# Altium schematic sheet Temctrl_I.SchDoc
size A4
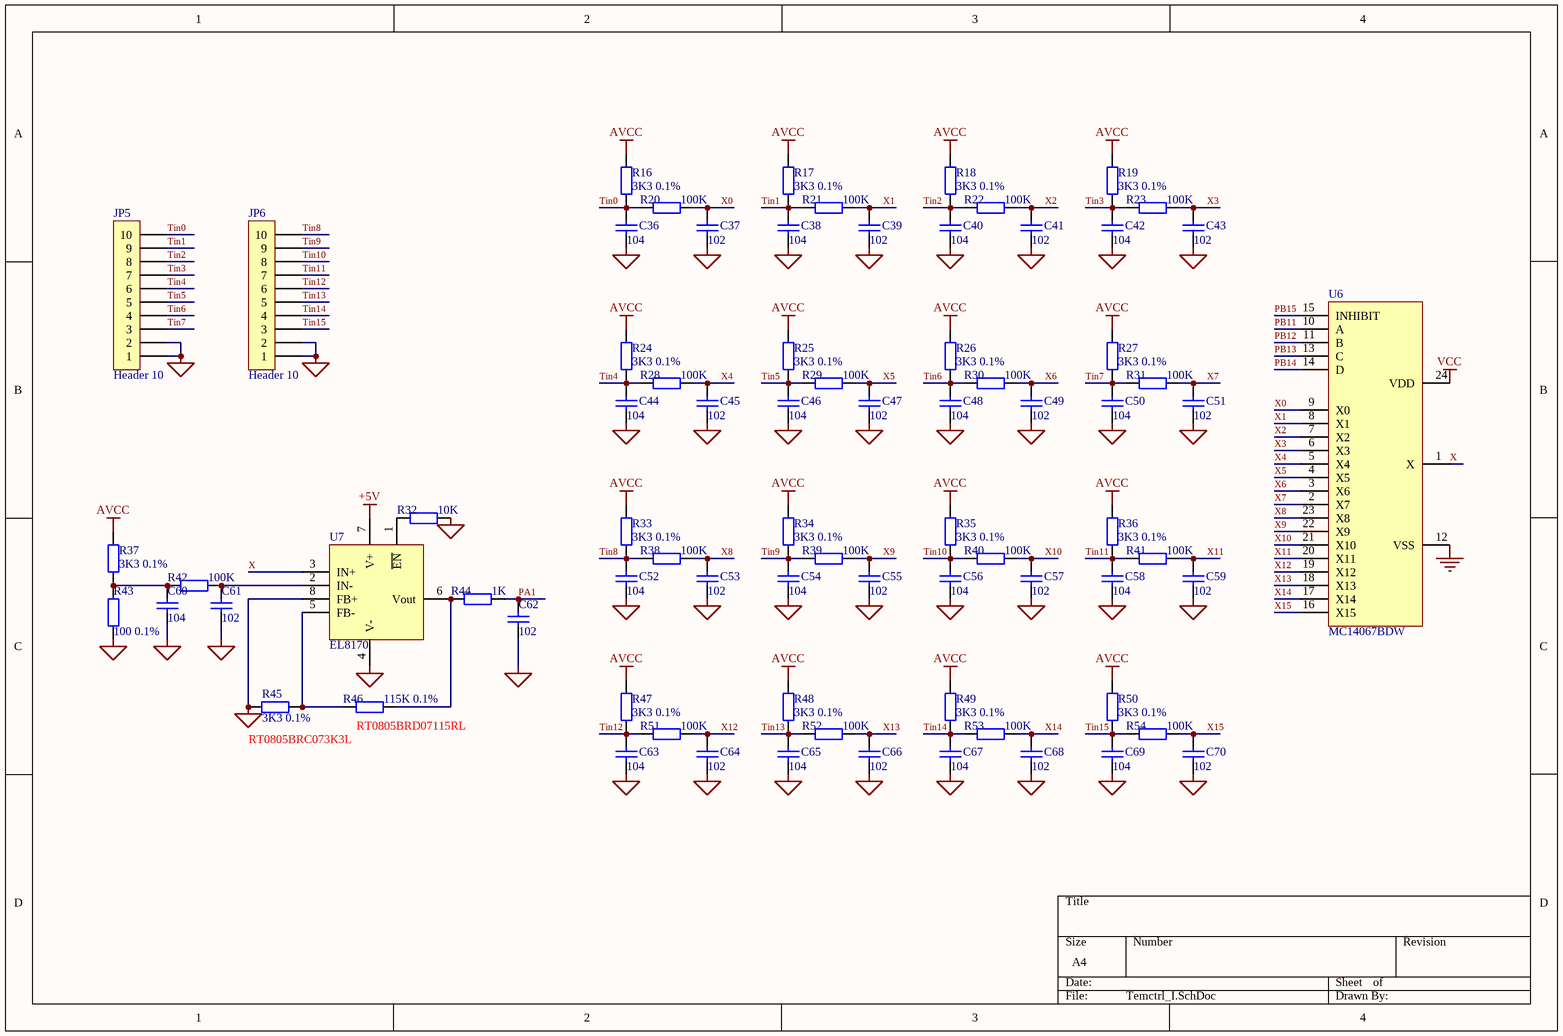
[diagram p0: Temctrl_I.SchDoc]

## Parts
C36  104  [0805]
C37  102  [0805]
C38  104  [0805]
C39  102  [0805]
C40  104  [0805]
C41  102  [0805]
C42  104  [0805]
C43  102  [0805]
C44  104  [0805]
C45  102  [0805]
C46  104  [0805]
C47  102  [0805]
C48  104  [0805]
C49  102  [0805]
C50  104  [0805]
C51  102  [0805]
C52  104  [0805]
C53  102  [0805]
C54  104  [0805]
C55  102  [0805]
C56  104  [0805]
C57  102  [0805]
C58  104  [0805]
C59  102  [0805]
C60  104  [0805]
C61  102  [0805]
C62  102  [0805]
C63  104  [0805]
C64  102  [0805]
C65  104  [0805]
C66  102  [0805]
C67  104  [0805]
C68  102  [0805]
C69  104  [0805]
C70  102  [0805]
JP5  Header 10  [HEAD10B-H - X]
JP6  Header 10  [HEAD10B-H - X]
R16  3K3 0.1%  [0805]
R17  3K3 0.1%  [0805]
R18  3K3 0.1%  [0805]
R19  3K3 0.1%  [0805]
R20  100K  [0805]
R21  100K  [0805]
R22  100K  [0805]
R23  100K  [0805]
R24  3K3 0.1%  [0805]
R25  3K3 0.1%  [0805]
R26  3K3 0.1%  [0805]
R27  3K3 0.1%  [0805]
R28  100K  [0805]
R29  100K  [0805]
R30  100K  [0805]
R31  100K  [0805]
R32  10K  [0805]
R33  3K3 0.1%  [0805]
R34  3K3 0.1%  [0805]
R35  3K3 0.1%  [0805]
R36  3K3 0.1%  [0805]
R37  3K3 0.1%  [0805]
R38  100K  [0805]
R39  100K  [0805]
R40  100K  [0805]
R41  100K  [0805]
R42  100K  [0805]
R43  100 0.1%  [0805]
R44  1K  [0805]
R45  3K3 0.1%  [0805]
R46  115K 0.1%  [0805]
R47  3K3 0.1%  [0805]
R48  3K3 0.1%  [0805]
R49  3K3 0.1%  [0805]
R50  3K3 0.1%  [0805]
R51  100K  [0805]
R52  100K  [0805]
R53  100K  [0805]
R54  100K  [0805]
U6  MC14067BDW  [751E-04_M]
U7  EL8170  [751-06_M]

## Nets
+5V: U7.7(V+)
AGND: C36.2 C37.1 C38.2 C39.1 C40.2 C41.1 C42.2 C43.1 C44.2 C45.1 C46.2 C47.1 C48.2 C49.1 C50.2 C51.1 C52.2 C53.1 C54.2 C55.1 C56.2 C57.1 C58.2 C59.1 C60.1 C61.1 C62.1 C63.2 C64.1 C65.2 C66.1 C67.2 C68.1 C69.2 C70.1 JP5.1 JP5.2 JP6.1 JP6.2 R32.2 R43.1 R45.1 U7.4(V-) U7.8(FB+)
AVCC: R16.2 R17.2 R18.2 R19.2 R24.2 R25.2 R26.2 R27.2 R33.2 R34.2 R35.2 R36.2 R37.2 R47.2 R48.2 R49.2 R50.2
GND: U6.12(VSS)
VCC: U6.24(VDD)
PA1: C62.2 R44.2
PB11: U6.10(A)
PB12: U6.11(B)
PB13: U6.13(C)
PB14: U6.14(D)
PB15: U6.15(INHIBIT)
Tin0: C36.1 JP5.10 R16.1 R20.1
Tin1: C38.1 JP5.9 R17.1 R21.1
Tin2: C40.1 JP5.8 R18.1 R22.1
Tin3: C42.1 JP5.7 R19.1 R23.1
Tin4: C44.1 JP5.6 R24.1 R28.1
Tin5: C46.1 JP5.5 R25.1 R29.1
Tin6: C48.1 JP5.4 R26.1 R30.1
Tin7: C50.1 JP5.3 R27.1 R31.1
Tin8: C52.1 JP6.10 R33.1 R38.1
Tin9: C54.1 JP6.9 R34.1 R39.1
Tin10: C56.1 JP6.8 R35.1 R40.1
Tin11: C58.1 JP6.7 R36.1 R41.1
Tin12: C63.1 JP6.6 R47.1 R51.1
Tin13: C65.1 JP6.5 R48.1 R52.1
Tin14: C67.1 JP6.4 R49.1 R53.1
Tin15: C69.1 JP6.3 R50.1 R54.1
X: U6.1(X) U7.3(IN+)
X0: C37.2 R20.2 U6.9(X0)
X1: C39.2 R21.2 U6.8(X1)
X2: C41.2 R22.2 U6.7(X2)
X3: C43.2 R23.2 U6.6(X3)
X4: C45.2 R28.2 U6.5(X4)
X5: C47.2 R29.2 U6.4(X5)
X6: C49.2 R30.2 U6.3(X6)
X7: C51.2 R31.2 U6.2(X7)
X8: C53.2 R38.2 U6.23(X8)
X9: C55.2 R39.2 U6.22(X9)
X10: C57.2 R40.2 U6.21(X10)
X11: C59.2 R41.2 U6.20(X11)
X12: C64.2 R51.2 U6.19(X12)
X13: C66.2 R52.2 U6.18(X13)
X14: C68.2 R53.2 U6.17(X14)
X15: C70.2 R54.2 U6.16(X15)
NetC60_2: C60.2 R37.1 R42.1 R43.2
NetC61_2: C61.2 R42.2 U7.2(IN-)
NetR32_1: R32.1 U7.1(~{EN})
NetR44_1: R44.1 R46.1 U7.6(Vout)
NetR45_2: R45.2 R46.2 U7.5(FB-)

## Notes on the sheet
- RT0805BRC073K3L
- (near R46) RT0805BRD07115RL

## Library data of the parts
C36-C70 = CAP: Capacitor; Manufacturer: Generic Components; Class: Passive; Published: 08/06/2000; Publisher: Altium Hobart Technology Centre; SubClass: Capacitor
JP5 JP6 = Header 10: Header, 10-Pin; Manufacturer: Generic Components; Class: Connector
R16-R54 = Res: Resistor; Manufacturer: Generic Components; Class: Passive; Published: 08/06/2000; Publisher: Altium Hobart Technology Centre; SubClass: Resistor
U6 = MC14067